# EAGLE design starduino (EAGLE 9.1.0)
DOC_NUM: 1; REVISION: 2.0
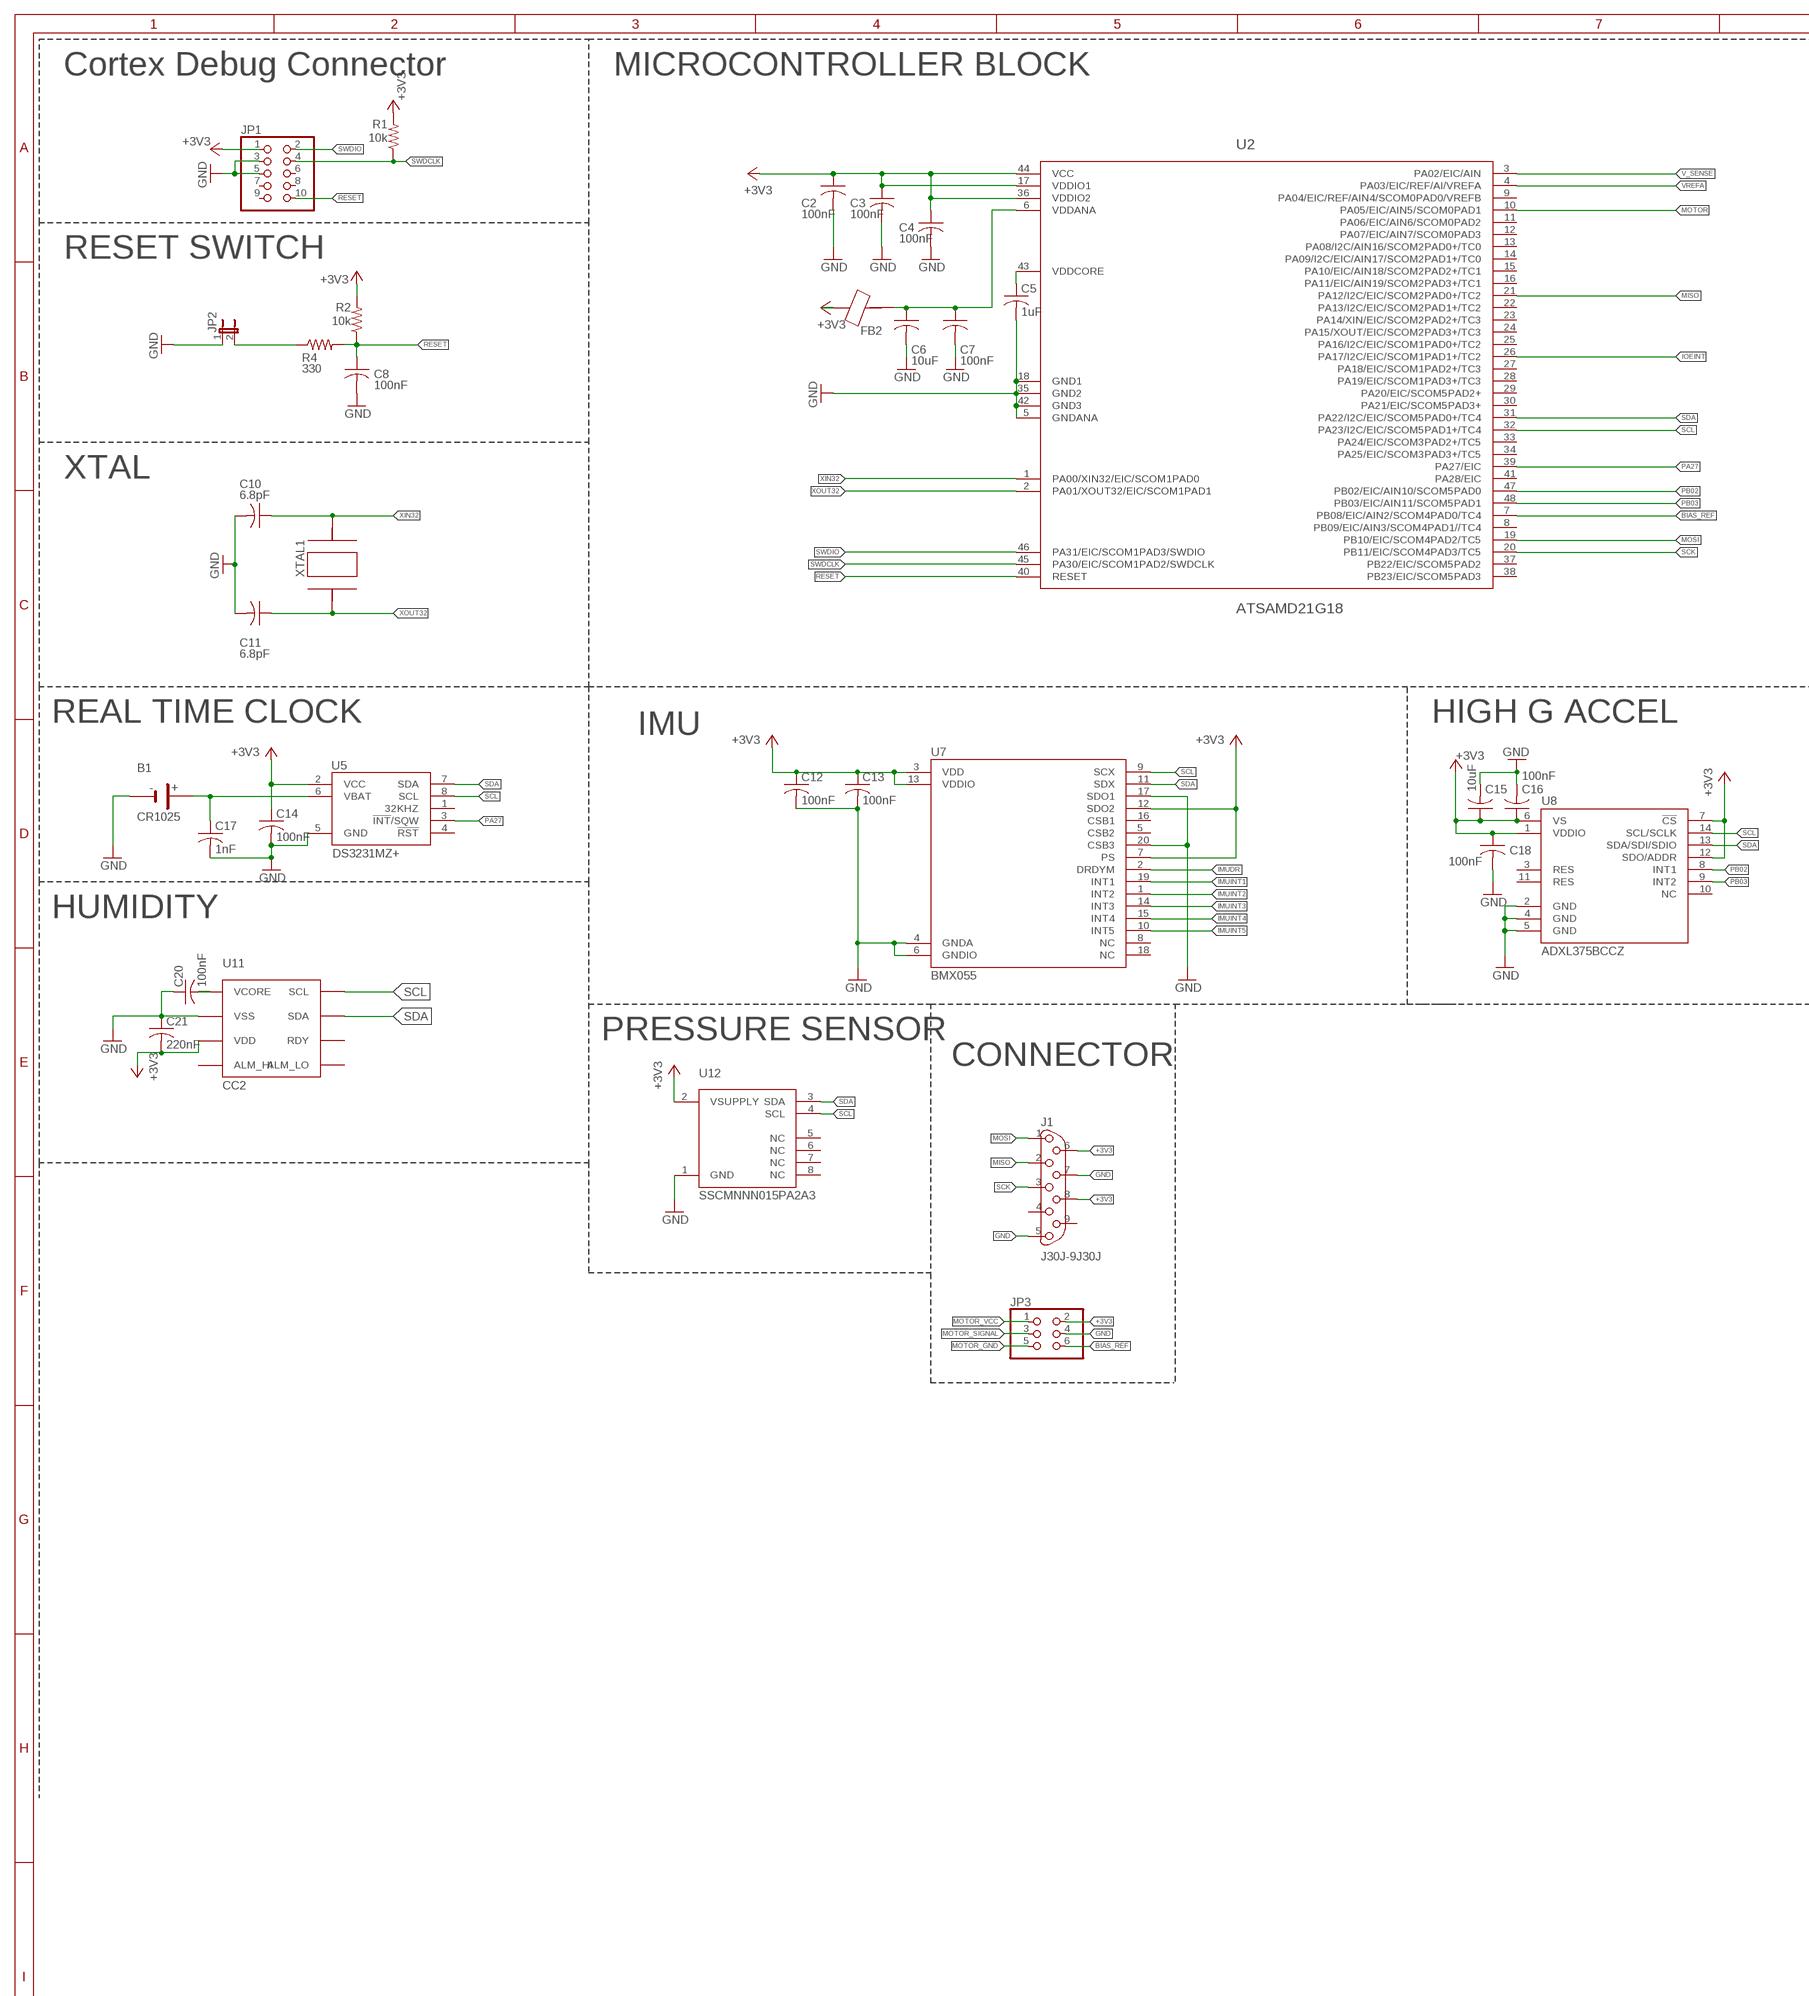
[diagram p0: schematic, sheet 1, part 1 of 2]
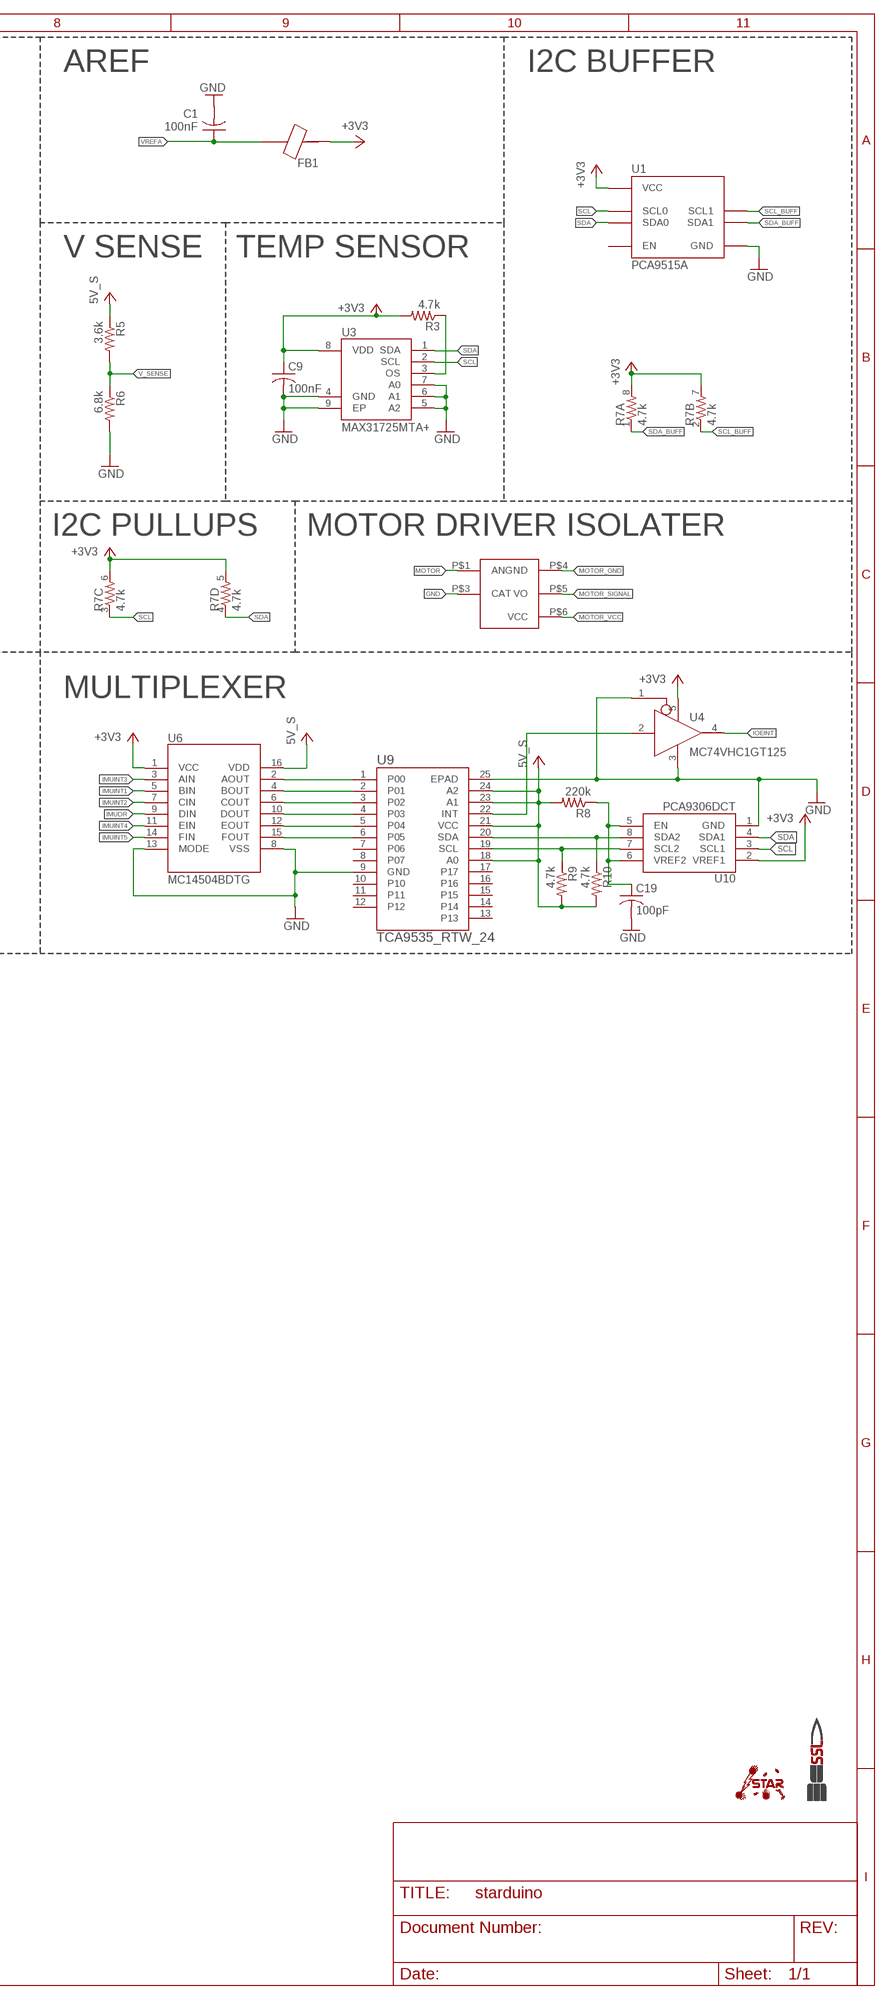
[diagram p1: schematic, sheet 1, part 2 of 2]

## Parts
B1  CR1025  [CR1025]
C1  100nF  C-USC0603  [C0603]
C2  100nF  C-USC0603  [C0603]
C3  100nF  C-USC0603  [C0603]
C4  100nF  C-USC0603  [C0603]
C5  1uF  C-USC0603  [C0603]
C6  10uF  C-USC0603  [C0603]
C7  100nF  C-USC0603  [C0603]
C8  100nF  C-USC0603  [C0603]
C9  100nF  C-USC0603  [C0603]
C10  6.8pF  C-USC0603  [C0603]
C11  6.8pF  C-USC0603  [C0603]
C12  100nF  C-USC0603  [C0603]
C13  100nF  C-USC0603  [C0603]
C14  100nF  C-USC0603  [C0603]
C15  10uF  C-USC0603  [C0603]
C16  100nF  C-USC0603  [C0603]
C17  1nF  C-USC0603  [C0603]
C18  100nF  C-USC0603  [C0603]
C19  100pF  C-USC0603  [C0603]
C20  100nF  C-USC0603  [C0603]
C21  220nF  C-USC0603  [C0603]
FB1  BLM18KG221BH1D  FERRITE_BEAD-0603  [0603]
FB2  BLM18KG221BH1D  FERRITE_BEAD-0603  [0603]
IMAG1  SSL.3IN_SILK  [SSL_SILK_.3IN]
IMAG2  STAR  [STAR_.3IN]
J1  J30J-9J30J  [ZKN-9]
JP1  PINHD-2X5  [2X05]
JP2  JUMPER-2PTH  [1X02]
JP3  PINHD-2X3  [2X03]
R1  10k  R-US_R0603  [R0603]
R2  10k  R-US_R0603  [R0603]
R3  4.7k  R-US_R0603  [R0603]
R4  330  R-US_R0603  [R0603]
R5  3.6k  R-US_R0603  [R0603]
R6  6.8k  R-US_R0603  [R0603]
R7  4.7k  RESISTOR-ARRAY0603-ARV  [0603-ARV]
R8  220k  R-US_R0603  [R0603]
R9  4.7k  R-US_R0603  [R0603]
R10  4.7k  R-US_R0603  [R0603]
U1  PCA9515A  [TSSOP8]
U2  ATSAMD21G18  [48-TQFP]
U3  MAX31725MTA+  [DFN-8]
U4  MC74VHC1GT125  [SC-70-5]
U5  DS3231MZ+  [SOIC-8]
U6  MC14504BDTG  [TSSOP16]
U7  BMX055  [LGA-20]
U8  ADXL375BCCZ  [LGA-14]
U9  TCA9535_RTW_24  [RTW24_2P45X2P45]
U10  PCA9306DCT  [SSOP8]
U11  CC2  [CC2]
U12  SSCMNNN015PA2A3  [HSC-SMT-8]
U$1  FODM8061-D  [SO5]
XTAL1  ABS07AIG-32.768KHZ-1-T  ABS07AIG-32.768KHZ-1-T  [2-SMD]

## Nets
5V_S: R5.1 R8.2 R9.2 R10.2 U6.16(VDD) U9.18(A0) U9.21(VCC) U9.23(A1) U9.24(A2)
+3V3: C2.1 C3.1 C4.1 C9.1 C12.1 C13.1 C14.1 C15.1 C16.1 C18.1 C21.2 FB1.2 FB2.1 J1.6 J1.8 JP1.1 JP3.2 R1.2 R2.2 R3.2 R7.5 R7.6 R7.7 R7.8 U1.P$8(VCC) U2.17(VDDIO1) U2.36(VDDIO2) U2.44(VCC) U3.8(VDD) U4.5(VIN) U5.2(VCC) U6.1(VCC) U7.3(VDD) U7.7(PS) U7.12(SDO2) U7.13(VDDIO) U8.1(VDDIO) U8.6(VS) U8.7(!CS!) U8.12(SDO/ADDR) U10.2(VREF1) U11.P$7(VDD) U12.2(VSUPPLY)
BIAS_REF: JP3.6 U2.7(PB08/EIC/AIN2/SCOM4PAD0/TC4)
GND: B1.3(-) C1.2 C2.2 C3.2 C4.2 C5.2 C6.2 C7.2 C8.2 C9.2 C10.2 C11.2 C12.2 C13.2 C14.2 C15.2 C16.2 C17.2 C18.2 C19.2 C20.1 C21.1 J1.5 J1.7 JP1.3 JP1.5 JP2.1 JP3.4 R6.2 U1.P$4(GND) U2.5(GNDANA) U2.18(GND1) U2.35(GND2) U2.42(GND3) U3.4(GND) U3.5(A2) U3.6(A1) U3.7(A0) U3.9(EP) U4.1(OE) U4.3(GND) U5.5(GND) U6.8(VSS) U6.13(MODE) U7.4(GNDA) U7.6(GNDIO) U7.17(SDO1) U7.20(CSB3) U8.2(GND) U8.4(GND) U8.5(GND) U9.9(GND) U9.25(EPAD) U10.1(GND) U11.P$6(VSS) U12.1(GND) U$1.P$3(CAT)
IMUDR: U6.9(DIN) U7.2(DRDYM)
IMUINT1: U6.5(BIN) U7.19(INT1)
IMUINT2: U6.7(CIN) U7.1(INT2)
IMUINT3: U6.3(AIN) U7.14(INT3)
IMUINT4: U6.11(EIN) U7.15(INT4)
IMUINT5: U6.14(FIN) U7.10(INT5)
IOEINT: U2.26(PA17/I2C/EIC/SCOM1PAD1+/TC2) U4.4(Y)
MISO: J1.2 U2.21(PA12/I2C/EIC/SCOM2PAD0+/TC2)
MOSI: J1.1 U2.19(PB10/EIC/SCOM4PAD2/TC5)
MOTOR: U2.10(PA05/EIC/AIN5/SCOM0PAD1) U$1.P$1(AN)
MOTOR_GND: JP3.5 U$1.P$4(GND)
MOTOR_SIGNAL: JP3.3 U$1.P$5(VO)
MOTOR_VCC: JP3.1 U$1.P$6(VCC)
N$2: C20.2 U11.P$5(VCORE)
N$5: C5.1 U2.43(VDDCORE)
N$6: R3.1 U3.3(OS)
N$7: JP2.2 R4.1
N$8: B1.1(+) B1.2(+) C17.1 U5.6(VBAT)
N$10: C6.1 C7.1 FB2.2 U2.6(VDDANA)
N$19: U6.2(AOUT) U9.1(P00)
N$23: U6.4(BOUT) U9.2(P01)
N$25: U4.2(A) U9.22(INT)
N$28: U6.6(COUT) U9.3(P02)
N$29: U6.10(DOUT) U9.4(P03)
N$30: U6.12(EOUT) U9.5(P04)
N$31: U6.15(FOUT) U9.6(P05)
N$33: R10.1 U9.20(SDA) U10.8(SDA2)
N$34: R9.1 U9.19(SCL) U10.7(SCL2)
N$35: C19.1 R8.1 U10.5(EN) U10.6(VREF2)
PA27: U2.39(PA27/EIC) U5.3(!INT!/SQW)
PB02: U2.47(PB02/EIC/AIN10/SCOM5PAD0) U8.8(INT1)
PB03: U2.48(PB03/EIC/AIN11/SCOM5PAD1) U8.9(INT2)
RESET: C8.1 JP1.10 R2.1 R4.2 U2.40(RESET)
SCK: J1.3 U2.20(PB11/EIC/SCOM4PAD3/TC5)
SCL: R7.3 U1.P$2(SCL0) U2.32(PA23/I2C/EIC/SCOM5PAD1+/TC4) U3.2(SCL) U5.8(SCL) U7.9(SCX) U8.14(SCL/SCLK) U10.3(SCL1) U11.P$4(SCL) U12.4(SCL)
SCL_BUFF: R7.2 U1.P$7(SCL1)
SDA: R7.4 U1.P$3(SDA0) U2.31(PA22/I2C/EIC/SCOM5PAD0+/TC4) U3.1(SDA) U5.7(SDA) U7.11(SDX) U8.13(SDA/SDI/SDIO) U10.4(SDA1) U11.P$3(SDA) U12.3(SDA)
SDA_BUFF: R7.1 U1.P$6(SDA1)
SWDCLK: JP1.4 R1.1 U2.45(PA30/EIC/SCOM1PAD2/SWDCLK)
SWDIO: JP1.2 U2.46(PA31/EIC/SCOM1PAD3/SWDIO)
V_SENSE: R5.2 R6.1 U2.3(PA02/EIC/AIN)
VREFA: C1.1 FB1.1 U2.4(PA03/EIC/REF/AI/VREFA)
XIN32: C10.1 U2.1(PA00/XIN32/EIC/SCOM1PAD0) XTAL1.P2
XOUT32: C11.1 U2.2(PA01/XOUT32/EIC/SCOM1PAD1) XTAL1.P1
Unconnected: J1.4 J1.9 JP1.6 JP1.7 JP1.8 JP1.9 U1.P$5(EN) U2.8(PB09/EIC/AIN3/SCOM4PAD1//TC4) U2.9(PA04/EIC/REF/AIN4/SCOM0PAD0/VREFB) U2.11(PA06/EIC/AIN6/SCOM0PAD2) U2.12(PA07/EIC/AIN7/SCOM0PAD3) U2.13(PA08/I2C/AIN16/SCOM2PAD0+/TC0) U2.14(PA09/I2C/EIC/AIN17/SCOM2PAD1+/TC0) U2.15(PA10/EIC/AIN18/SCOM2PAD2+/TC1) U2.16(PA11/EIC/AIN19/SCOM2PAD3+/TC1) U2.22(PA13/I2C/EIC/SCOM2PAD1+/TC2) U2.23(PA14/XIN/EIC/SCOM2PAD2+/TC3) U2.24(PA15/XOUT/EIC/SCOM2PAD3+/TC3) U2.25(PA16/I2C/EIC/SCOM1PAD0+/TC2) U2.27(PA18/EIC/SCOM1PAD2+/TC3) U2.28(PA19/EIC/SCOM1PAD3+/TC3) U2.29(PA20/EIC/SCOM5PAD2+) U2.30(PA21/EIC/SCOM5PAD3+) U2.33(PA24/EIC/SCOM3PAD2+/TC5) U2.34(PA25/EIC/SCOM3PAD3+/TC5) U2.37(PB22/EIC/SCOM5PAD2) U2.38(PB23/EIC/SCOM5PAD3) U2.41(PA28/EIC) U5.1(32KHZ) U5.4(!RST!) U7.5(CSB2) U7.8(NC) U7.16(CSB1) U7.18(NC) U8.3(RES) U8.10(NC) U8.11(RES) U9.7(P06) U9.8(P07) U9.10 U9.11 U9.12 U9.13 U9.14 U9.15 U9.16 U9.17 U11.P$1(ALM_LO) U11.P$2(RDY) U11.P$8(ALM_HI) U12.5(NC) U12.6(NC) U12.7(NC) U12.8(NC)

## Notes on the sheet
- Cortex Debug Connector | MICROCONTROLLER BLOCK | AREF | I2C BUFFER
- RESET SWITCH
- V SENSE | TEMP SENSOR
- XTAL
- I2C PULLUPS | MOTOR DRIVER ISOLATER
- REAL TIME CLOCK | HIGH G ACCEL
- IMU | MULTIPLEXER
- HUMIDITY
- PRESSURE SENSOR
- CONNECTOR

## Library data of the parts
B1 = NR_connectors:CR1025
C1-C18 C20 C21 = resistor:C-US: CAPACITOR, American symbol
C19 = rcl:C-US: CAPACITOR, American symbol
FB1 FB2 = AR_passives:FERRITE_BEAD
IMAG1 = images:SSL
IMAG2 = images:STAR
J1 = CM_J30J:J30J-9
JP1 = pinhead:PINHD-2X5: PIN HEADER
JP2 = CM_passives:JUMPER-2: Jumper Basic 0.1" spaced jumper. Use with breakaway headers.
JP3 = pinhead:PINHD-2X3: PIN HEADER
R1-R6 = resistor:R-US_: RESISTOR, American symbol
R7 = SparkFun-Passives:RESISTOR-ARRAY: Array Chip Resistor Source: RS Component / Phycomp
R8-R10 = rcl:R-US_: RESISTOR, American symbol
U1 = CM_IC:PCA9515A
U2 = AR_mcu:ATSAMD21G18
U3 = NR_IC:MAX31725MTA+
U4 = CM_IC:MC74VHC1GT125
U5 = NR_IC:DS3231MZ+
U6 = MotorDriver:MC14504BDTG
U7 = NR_IC:BMX055
U8 = NR_IC:ADXL375BCCZ
U9 = MotorDriver:TCA9535_RTW_24; MANUFACTURER_PART_NUMBER: tca9535_rtw_24; VENDOR: Texas Instruments
U10 = MotorDriver:PCA9306
U11 = NR_IC:CC2
U12 = NR_IC:SSCMNNN015PA2A3
U$1 = optoisolater:FODM8061-D
XTAL1 = AR_XTAL:ABS07AIG-32.768KHZ-1-T

## Net classes
0 default: width 0.152 mm, drill 0.381 mm, clearance 0.152 mm
1 PWR_SIG: width 0.203 mm, drill 0.381 mm, clearance 0.152 mm
2 CTRL_SIG: width 0.203 mm, drill 0.381 mm, clearance 0.152 mm
3 DIFF_PAIR: width 0.152 mm, drill 0.33 mm, clearance 0.152 mm

## Board
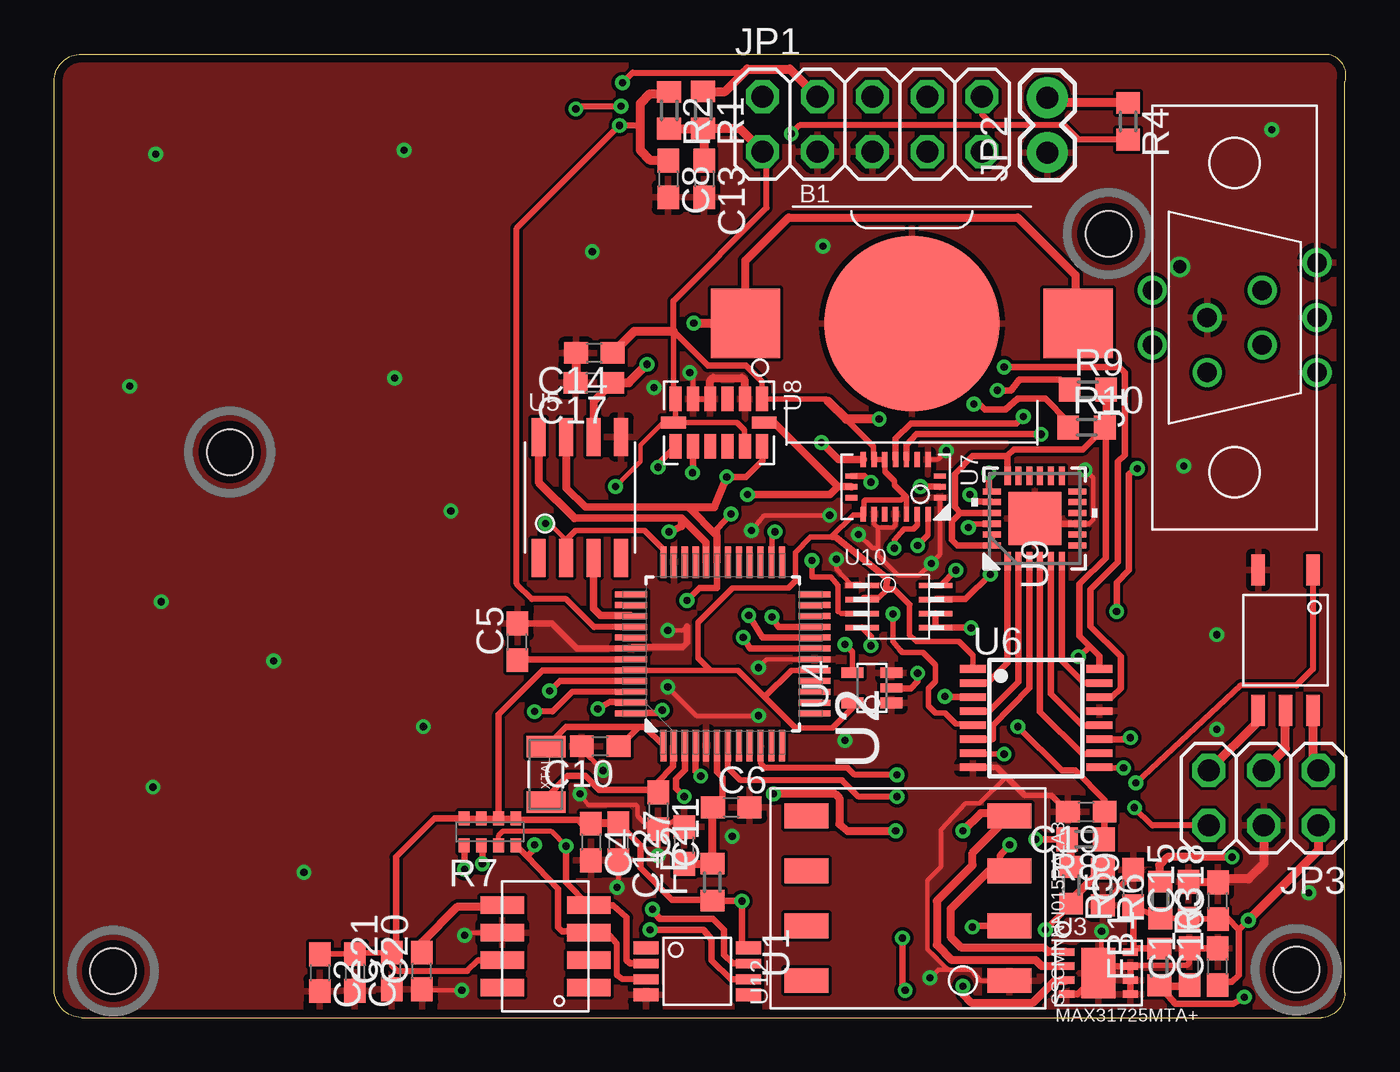
[diagram p2: board, top side]
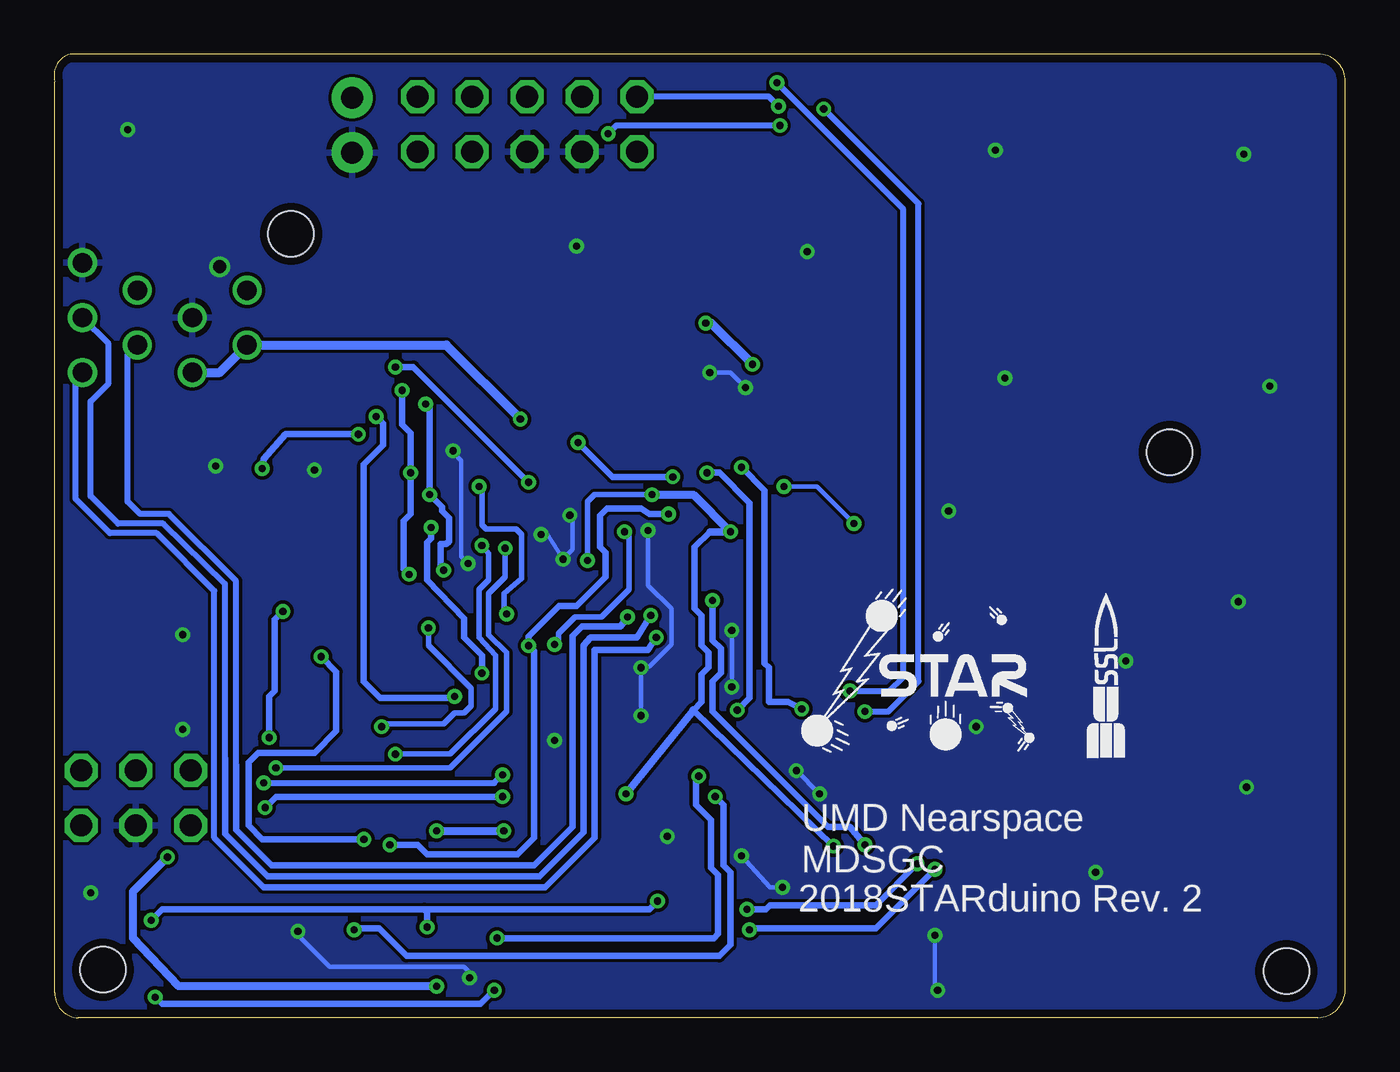
[diagram p3: board, bottom side, seen from below]

Size 59.73 x 44.58 mm. Coordinates in mm from the lower left corner, seen from the top.
Outline: 1.27,0 58.61,0 arc90 59.69,1.14 59.69,43.31 arc90 58.99,44.58 1.27,44.58 arc90 0,43.31 0,1.4 arc90 1.27,0
Copper layers (1*16): Top 0.0356mm / dielectric 1.5011mm / Bottom 0.0356mm
Design rules "OshPark *": minimum track width 6mil, minimum drill 12mil, track to track 6mil, track to pad 6mil, pad to pad 6mil, via to via 6mil, smd to smd 6mil, copper to edge 15mil, drill to drill 6mil, minimum pad ring 7mil, minimum via ring 7mil, stop-mask expansion 3mil, vias tented up to drill 25mil, thermal gap 10mil
Holes 2.1 mm at 8.13,26.16 48.77,36.26 57.47,2.22 2.73,2.16

### Footprints (pad centres in the part's own frame; a part is rotated, then mirrored left to right if it is on the bottom)
CR1025 = smd 3.2 x 3.2: 1 -7.695,0; 2 7.695,0 | smd 8.13 x 8.13: 3 0,0
C0603 = smd 1.1 x 1: 1 -0.85,0; 2 0.85,0
0603 = smd 1 x 1.1: 1 -0.85,0; 2 0.85,0
ZKN-9 = drill 0.9: 1 -2.54,-3.81; 2 -1.27,-1.27; 3 0,-3.81; 4 1.27,-1.27; 5 2.54,-3.81; 6 -2.54,1.27; 7 0,1.27; 8 -1.27,3.81; 9 1.27,3.81
2X05 = drill 1.016 octagon: 1 -5.08,-1.27; 2 -5.08,1.27; 3 -2.54,-1.27; 4 -2.54,1.27; 5 0,-1.27; 6 0,1.27; 7 2.54,-1.27; 8 2.54,1.27; 9 5.08,-1.27; 10 5.08,1.27
1X02 = drill 1.016 pad 1.88: 1 0,0; 2 2.54,0
2X03 = drill 1.016 octagon: 1 -2.54,-1.27; 2 -2.54,1.27; 3 0,-1.27; 4 0,1.27; 5 2.54,-1.27; 6 2.54,1.27
R0603 = smd 1 x 1.1: 1 -0.85,0; 2 0.85,0
0603-ARV = smd 0.5 x 0.65: 1 -1.2,-0.625; 2 -0.4,-0.625; 3 0.4,-0.625; 4 1.2,-0.625; 5 1.2,0.625; 6 0.4,0.625; 7 -0.4,0.625; 8 -1.2,0.625
TSSOP8 = smd 0.6 x 1.15: P$1 -1.087,-2.375; P$4 1.087,-2.375; P$5 1.087,2.375; P$8 -1.087,2.375 | smd 0.45 x 1.15: P$2 -0.362,-2.375; P$3 0.362,-2.375; P$6 0.362,2.375; P$7 -0.362,2.375
48-TQFP = smd 1.473 x 0.279: 1 -4.242,2.743; 2 -4.242,2.261; 3 -4.242,1.753; 4 -4.242,1.245; 5 -4.242,0.762; 6 -4.242,0.254; 7 -4.242,-0.254; 8 -4.242,-0.762; 9 -4.242,-1.245; 10 -4.242,-1.753; 11 -4.242,-2.261; 12 -4.242,-2.743; 25 4.242,-2.743; 26 4.242,-2.261; 27 4.242,-1.753; 28 4.242,-1.245; 29 4.242,-0.762; 30 4.242,-0.254; 31 4.242,0.254; 32 4.242,0.762; 33 4.242,1.245; 34 4.242,1.753; 35 4.242,2.261; 36 4.242,2.743 | smd 0.279 x 1.473: 13 -2.743,-4.242; 14 -2.261,-4.242; 15 -1.753,-4.242; 16 -1.245,-4.242; 17 -0.762,-4.242; 18 -0.254,-4.242; 19 0.254,-4.242; 20 0.762,-4.242; 21 1.245,-4.242; 22 1.753,-4.242; 23 2.261,-4.242; 24 2.743,-4.242; 37 2.743,4.242; 38 2.261,4.242; 39 1.753,4.242; 40 1.245,4.242; 41 0.762,4.242; 42 0.254,4.242; 43 -0.254,4.242; 44 -0.762,4.242; 45 -1.245,4.242; 46 -1.753,4.242; 47 -2.261,4.242; 48 -2.743,4.242
DFN-8 = smd 0.7 x 0.35: 1 -1.475,0.975; 2 -1.475,0.325; 3 -1.475,-0.325; 4 -1.475,-0.975; 5 1.475,-0.975; 6 1.475,-0.325; 7 1.475,0.325; 8 1.475,0.975 | smd 1.58 x 2.35: 9 0,0
SC-70-5 = smd 0.5 x 1: 1 -0.7,-0.9; 3 0.7,-0.9; 4 0.7,0.9; 5 -0.7,0.9 | smd 0.4 x 1: 2 0,-0.9
SOIC-8 = smd 0.65 x 1.75: 1 -1.905,-2.8; 2 -0.635,-2.8; 3 0.635,-2.8; 4 1.905,-2.8; 5 1.905,2.8; 6 0.635,2.8; 7 -0.635,2.8; 8 -1.905,2.8
TSSOP16 = smd 0.35 x 1.2: 1 -2.275,-2.925; 2 -1.625,-2.925; 3 -0.975,-2.925; 4 -0.325,-2.925; 5 0.325,-2.925; 6 0.975,-2.925; 7 1.625,-2.925; 8 2.275,-2.925; 9 2.275,2.925; 10 1.625,2.925; 11 0.975,2.925; 12 0.325,2.925; 13 -0.325,2.925; 14 -0.975,2.925; 15 -1.625,2.925; 16 -2.275,2.925
LGA-20 = smd 0.675 x 0.25: 1 1.262,1.5; 2 1.262,1; 3 1.262,0.5; 4 1.262,0; 5 1.262,-0.5; 6 1.262,-1; 7 1.262,-1.5; 11 -1.262,-1.5; 12 -1.262,-1; 13 -1.262,-0.5; 14 -1.262,0; 15 -1.262,0.5; 16 -1.262,1; 17 -1.262,1.5 | smd 0.25 x 0.55: 8 0.5,-2.05; 9 0,-2.05; 10 -0.5,-2.05; 18 -0.5,2.05; 19 0,2.05; 20 0.5,2.05
LGA-14 = smd 1.145 x 0.55: 1 -1.097,2; 2 -1.097,1.2; 3 -1.097,0.4; 4 -1.097,-0.4; 5 -1.097,-1.2; 6 -1.097,-2; 8 1.097,-2; 9 1.097,-1.2; 10 1.097,-0.4; 11 1.097,0.4; 12 1.097,1.2; 13 1.097,2 | smd 0.55 x 1.145: 7 0,-2.098; 14 0,2.098
RTW24_2P45X2P45 = smd 0.85 x 0.28: 1 -1.975,1.25; 2 -1.975,0.75; 3 -1.975,0.25; 4 -1.975,-0.25; 5 -1.975,-0.75; 6 -1.975,-1.25; 13 1.975,-1.25; 14 1.975,-0.75; 15 1.975,-0.25; 16 1.975,0.25; 17 1.975,0.75; 18 1.975,1.25 | smd 0.28 x 0.85: 7 -1.25,-1.975; 8 -0.75,-1.975; 9 -0.25,-1.975; 10 0.25,-1.975; 11 0.75,-1.975; 12 1.25,-1.975; 19 1.25,1.975; 20 0.75,1.975; 21 0.25,1.975; 22 -0.25,1.975; 23 -0.75,1.975; 24 -1.25,1.975 | smd 2.45 x 2.45: 25 0,0
SSOP8 = smd 0.25 x 1.55: 1 -0.975,-1.7; 2 -0.325,-1.7; 3 0.325,-1.7; 4 0.975,-1.7; 5 0.975,1.7; 6 0.325,1.7; 7 -0.325,1.7; 8 -0.975,1.7
CC2 = smd 2 x 0.8: P$1 2,-1.905; P$2 2,-0.635; P$3 2,0.635; P$4 2,1.905; P$5 -2,1.905; P$6 -2,0.635; P$7 -2,-0.635; P$8 -2,-1.905
HSC-SMT-8 = smd 1.143 x 2.032: 1 -3.81,-4.699; 2 -1.27,-4.699; 3 1.27,-4.699; 4 3.81,-4.699; 5 3.81,4.699; 6 1.27,4.699; 7 -1.27,4.699; 8 -3.81,4.699
SO5 = smd 0.61 x 1.45: P$1 1.27,3.25; P$3 -1.27,3.25; P$4 -1.27,-3.25; P$5 0,-3.25; P$6 1.27,-3.25
2-SMD = smd 1 x 1.8: P1 -1.275,0; P2 1.275,0

### Placement (x,y rotation side)
B1  39.67,32.12 0 top
C1  52.51,2.37 90 top
C2  12.29,2.08 270 top
C3  13.91,2.1 270 top
C4  24.83,8.13 270 top
C5  21.43,17.38 90 top
C6  31.32,9.73 0 top
C7  29.15,7.97 90 top
C8  28.4,38.8 270 top
C9  49.91,6 90 top
C10  25.26,12.56 180 top
C11  27.94,9.57 270 top
C12  26.1,8.14 270 top
C13  30.07,38.8 270 top
C14  24.99,30.75 180 top
C15  52.47,5.43 90 top
C16  53.82,2.37 90 top
C17  24.97,29.37 180 top
C18  53.83,5.41 90 top
C19  47.74,9.53 180 top
C20  17.02,2.16 90 top
C21  15.62,2.16 90 top
FB1  51.12,2.35 90 top
FB2  30.45,6.27 90 top
IMAG1  12.3,12.03 0 bottom
IMAG2  25.16,12.27 0 bottom
J1  54.61,32.39 90 top
JP1  37.85,41.34 0 top
JP2  45.94,40.02 90 top
JP3  55.94,10.16 180 top
R1  30.02,41.99 270 top
R2  28.45,41.97 270 top
R3  51.17,5.45 270 top
R4  49.67,41.47 270 top
R5  47.04,6.13 270 top
R6  48.51,6.05 270 top
R7  20.16,8.6 0 top
R8  47.7,8.26 180 top
R9  47.82,29.05 0 top
R10  47.75,27.3 0 top
U1  29.75,2.14 270 top
U2  30.92,16.83 90 top
U3  48.31,2.06 0 top
U4  37.83,15.26 90 top
U5  24.32,24.07 0 top
U6  45.42,13.86 270 top
U7  38.93,24.56 270 top
U8  30.75,27.53 270 top
U9  45.36,23.1 90 top
U10  39.07,19.02 270 top
U11  22.73,3.3 0 top
U12  39.5,5.52 90 top
U$1  56.96,17.46 0 top
XTAL1  22.75,11.26 90 top

### Tracks (layer width: path | path; a pad name or v marks a point on that pad's centre or on a via)
5V_S  (via drill 0.33 pad 0.33)
  Top 0.305: U9.23 U9.24 41.78,21.85 41.53,22.1 41.53,22.95 41.93,23.35 | U9.18 44.11,26.01 | 44.11,26.01 44.39,26.29 47.59,26.29 R10.2 48.64,27.27 48.64,21.27 47.43,20.07 47.43,17.65 47.91,17.18 | U9.21 41.93,23.35 | 41.93,23.35 41.66,23.62 41.66,25.15 42.48,25.97 44.07,25.97 44.11,26.01 | U6.16 48.34,16.74 47.91,17.18 | R8.2 v45.4,8.26 | v47.37,16.7 47.43,16.7 47.91,17.18
  Top 0.381: R5.1 47.04,8.07 R8.2 | R9.2 48.67,27.37 R10.2
  Bottom 0.305: v45.4,8.26 50.1,8.26 50.74,8.89 50.74,11.81 50.29,12.26 47.69,12.26 46.67,13.27 46.67,16 v47.37,16.7
+3V3  (via drill 0.33, 0.33 pad 0.33)
  Top 0.203: U8.7 28.16,27.53 27.11,26.48 27.11,25.72 v25.97,24.57 | v22.73,22.86 22.92,22.86 23.69,22.1
  Top 0.254: 28.65,31.75 28.65,28.73 U8.6 28.75,27.62 U8.7 31.59,27.53 31.94,27.18 31.94,26.44 U8.12 | 38.54,19.81 38.16,19.43 37.46,19.43 U10.2 | U5.2 23.69,22.1 24.13,22.54 27.31,22.54 28.19,21.65 28.19,21.08 U2.36 | C21.2 13.97,3.01 C3.1 12.3,2.95 C2.1 | C9.1 51.21,4.58 R3.2 52.51,4.59 C15.1 53.82,4.58 C18.1 | U4.5 36.93,14.32 36.01,13.4 34.29,13.4 32.86,14.83 | R7.8 R7.7 R7.6 R7.5 | 32,30.16 32.75,29.42 U8.1 35.7,28.62 35.81,28.51 37.91,26.42 37.91,25.84 U7.12 U7.13 38.43,25.27 38.86,24.83 38.86,24.64 39.37,24.13 | U6.1 42.49,16.75 41.85,17.4 39.88,17.4 39.56,17.72 39.56,19.11 | 35.94,22.22 34.99,22.22 34.29,21.53 34.29,20.19 33.97,19.88 31.37,19.88 29.78,18.29 29.78,16.64 30.35,16.07 | 35.94,22.22 36.01,22.22 | 37.47,23.26 U7.7 | 37.47,23.26 36.97,23.26 35.94,22.22 | U2.44 30.35,16.07 | 32.86,14.83 31.62,16.07 30.35,16.07 | U7.3 39.43,24.07 39.37,24.13 | 37.47,23.26 37.47,23.88 37.53,23.94 39.18,23.94 39.37,24.13 | U2.17 34.1,16.07 32.86,14.83
  Top 0.279: C21.2 15.62,2.41 15.88,2.16 19.11,2.16 19.62,2.67 U11.P$7 | 28.65,31.75 28.65,33.16 32.96,37.47 32.96,39.88 JP1.1
  Top 0.305: 32,30.16 30.24,30.16 28.65,31.75 | U2.44 22.61,16.07 20.56,14.02 R7.6 | FB1.2 49.94,3.2 U3.8 49.91,3.17 C9.1 | C18.1 54.3,4.56 54.8,4.06 | 54.8,4.06 54.8,1.97 54.48,1.65 53.95,1.65 C16.1 | R7.5 21.45,9.14 24.26,9.14 24.42,8.98 C4.1 | v55.25,4.51 54.8,4.06 | 39.56,19.11 38.86,19.81 38.54,19.81 38.48,19.88 38.54,20.32 36.13,22.22 36.01,22.22 | FB2.1 30.47,5.4 v31.81,5.4 31.81,3.42 U1.P$8 | U12.2 42.55,4.25 v42.48,4.19 | R7.8 17.61,9.23 15.81,7.43 15.81,3.2 C21.2 | 30.42,5.45 28.58,5.45 27.11,6.92 27.11,7.98 C12.1
  Top 0.381: C12.1 24.84,8.99 C4.1 | 30.42,5.45 FB2.1
  Top 0.406: JP3.2 58.48,7.75 v55.25,4.51 | v38.16,27.69 36.64,27.69 35.81,28.51 | R2.2 30,41.12 | 30,41.12 R1.2 31.7,41.14 JP1.1 | C14.1 26.84,31.75 28.65,31.75 | 30,41.12 30.07,41.06 C13.1
  Bottom 0.203: v25.97,24.57 24.45,24.57 v22.73,22.86
  Bottom 0.305: v55.25,4.51 54.74,5.02 42.61,5.02 | 42.61,5.02 32.19,5.02 v31.81,5.4 | v42.48,4.19 42.48,4.89 42.61,5.02
  Bottom 0.406: J1.6 52.07,29.84 J1.8 41.59,31.11 v38.16,27.69
BIAS_REF  (via drill 0.33 pad 0.33)
  Top 0.279: JP3.6 50.8,8.89 v49.97,9.71 | v38.99,10.22 37.21,10.22 36.45,10.99 31.75,10.99 31.18,11.56 U2.7
  Bottom 0.305: v49.97,9.71 49.47,10.22 v38.99,10.22
GND  (via drill 0.33, 0.33 pad 0.33, 0.6)
  Top 0.203: U8.5 29.55,29.76 v29.4,29.84 | C12.2 26.1,6.1 v26.04,6.03 | v27.94,7.49 C11.2 | v28.38,17.91 29.08,17.91 29.27,18.1 | C7.2 28.8,9.17 C11.2 | C11.2 27.84,8.83 27.5,8.83 26.99,9.33 26.99,9.78 26.92,9.84 24.7,9.84 v24.32,10.35 | v25.4,11.43 24.32,12.47 C10.2 | v28.38,15.3 29.72,13.97 v32.58,13.97 | U2.18 32.96,16.57 v32.58,16.19 | U12.1 42.86,1.71 42.42,2.22 41.34,2.22 | 41.34,2.22 40.39,3.17 40.39,6.35 41.02,6.98 41.02,8.7 42.16,9.91 42.8,9.91 44.04,11.14 | U7.6 37.93,22.84 38.1,22.67 | 38.1,22.67 38.8,22.67 38.93,22.8 U7.4 | v35.88,23.24 32.83,23.24 v32.26,22.54 | U7.17 40.87,25.82 v41.28,26.23 | U7.20 40.98,21.42 v40.58,21.02 40.01,20.45 39.05,20.45 38.1,21.4 38.1,21.72 | 38.1,22.67 38.1,21.72 | U9.9 47.87,22.85 48.07,23.05 48.07,24.95 v47.69,25.34 | v36.2,21.21 36.2,20.76 36.83,20.07 37.3,20.07 U10.1 | v37.21,22.35 37.85,21.72 38.1,21.72 | v40.51,1.84 40.89,2.22 41.34,2.22 | U3.4 46.89,1.14 48.26,1.14 48.45,1.33 v48.45,4 | U11.P$6 19.11,3.94 v18.99,3.81 | v18.86,1.27 17.06,1.27 C20.1
  Top 0.254: U8.5 U8.4 | C1.2 52.51,2.54 52.39,2.41 49.81,2.41 U3.7 | U6.8 43.6,11.58 44.04,11.14 44.9,10.29 46.12,10.29 C19.2
  Top 0.305: U9.9 45.61,22.85 U9.25 | 29.27,18.1 29.27,17.34 29.08,17.14 26.75,17.14 U2.42 24.19,17.08 23.04,18.23 C5.2 | C1.2 C16.2 | U3.5 U3.6 U3.7 48.63,2.39 U3.9 47.33,1.09 U3.4 | C9.2 49.91,6.72 R6.2
  Top 0.381: U8.4 30.35,29.46 30.48,29.59 31.81,29.59 31.94,29.46 U8.2 | C15.2 53.82,6.28 C18.2
  Top 0.406: JP3.4 55.94,7.11 55.25,6.41 53.98,6.41 C18.2 | C14.2 24.14,29.38 C17.2
  Bottom 0.203: v29.4,29.84 28.45,29.84 v27.75,29.15 | v26.04,6.03 26.61,6.03 v27.94,7.49 | v28.38,15.3 v28.38,17.91 | v24.32,10.35 v25.4,11.43 | v32.58,13.97 v32.58,16.19 32.19,16.26 31.18,17.27 31.18,18.92 32.26,20 v32.26,22.54 | v35.88,23.24 35.75,23.05 35.75,21.65 v36.2,21.21 36.89,22.35 v37.21,22.35 | v41.28,26.23 41.28,26.16 40.89,25.78 40.89,21.34 v40.58,21.02 | v40.51,1.84 40.51,2.09 40.77,2.35 46.99,2.35 48.45,3.81 v48.45,4 | v18.99,3.81 18.99,1.4 v18.86,1.27
  other vias: 35.56,35.69 36.58,12.83 31.37,8.38 18.35,23.43 53.78,13.34 58.04,5.78 52.07,34.73 4.7,39.94 16.19,40.13 15.75,29.59 3.49,29.21 4.95,19.24 10.16,16.51 17.08,13.46 4.57,10.67 11.56,6.73 53.78,17.72 52.26,25.53 56.32,41.08 24.89,35.43
  pour Bottom: -2.54,49.66 -2.54,-2.41 68.58,-2.41 68.58,49.66
  pour Top: -5.08,47.12 -5.08,-3.68 67.31,-3.68 67.31,47.12
IMUDR  (via drill 0.33, 0.33 pad 0.33)
  Top 0.254: U7.2 39.93,22.78 39.75,22.61 39.31,22.61 38.86,22.1 v38.86,21.72 | v49.47,11.56 48.37,11.56 U6.9
  Bottom 0.254: v38.86,21.72 38.86,20.38 39.62,19.62 39.62,17.72 38.8,16.89 38.8,14.16 41.4,11.56 v49.47,11.56
IMUINT1  (via drill 0.33)
  Top 0.254: v38.8,18.67 38.8,17.4 39.12,17.02 39.24,16.89 40.2,16.89 40.77,16.32 40.77,15.56 40.45,15.24 40.45,14.41 40.77,14.1 41.21,14.1 41.72,13.59 42.44,13.59 U6.5
  Top 0.305: v40.07,24.57 40.96,24.57 U7.19
  Bottom 0.254: 38.93,18.8 38.93,19.62 38.1,20.32 38.1,22.35 38.35,22.61 39.75,22.61 39.94,22.8 39.94,24.45 v40.07,24.57
  Bottom 0.305: 38.93,18.8 v38.8,18.67
IMUINT2  (via drill 0.33)
  Top 0.254: U7.1 40.43,22.33 v39.94,21.84 | v43.94,12.19 42.54,12.19 U6.7
  Bottom 0.254: v39.94,21.84 39.62,21.46 39.62,20.26 40.07,19.81 40.07,17.59 39.31,16.76 39.31,14.29 41.4,12.19 v43.94,12.19
IMUINT3  (via drill 0.33)
  Top 0.305: U6.3 41.36,14.83 v41.21,14.86 | U7.14 38.93,26.8 39.62,27.5 44.51,27.5 v44.83,27.81
  Bottom 0.305: v41.21,14.86 41.28,14.79 44.64,14.79 45.4,15.56 45.4,25.59 44.51,26.48 44.51,27.5 v44.83,27.81
IMUINT4  (via drill 0.33)
  Top 0.305: v45.66,26.99 39.88,26.99 39.43,26.48 39.43,25.83 U7.15 | v49.15,18.8 49.15,20.13 49.72,20.7 49.72,25.15 v50.1,25.4 | v49.78,12.95 49.71,12.88 U6.11
  Bottom 0.305: v45.66,26.99 49.02,26.99 50.04,25.84 v50.1,25.4 | v49.78,12.95 49.78,14.86 49.53,15.11 49.53,18.41 v49.15,18.8
IMUINT5  (via drill 0.33)
  Top 0.305: U6.14 48.93,14.83 49.34,15.24 49.34,16.7 47.94,18.1 47.94,19.81 49.21,21.08 49.21,25.72 49.53,26.04 49.53,29.84 49.28,30.1 v43.94,30.1 | v37.78,24.77 37.49,25.06 U7.10
  Bottom 0.305: v43.94,30.1 43.12,30.1 v37.78,24.77
IOEINT  (via drill 0.33)
  Top 0.254: v36.58,17.27 36.93,16.92 U4.4 | U2.26 33.21,21.09 33.21,22.35 v33.34,22.48
  Bottom 0.254: v36.58,17.27 36.39,17.46 36.39,17.78 35.62,18.54 34.42,18.54 33.15,19.81 33.15,22.29 v33.34,22.48
MISO  (via drill 0.33)
  Top 0.305: U2.21 33.5,18.07 v33.21,18.54
  Bottom 0.279: 51.31,11.68 51.31,20.19 54.42,23.3 55.75,23.3 56.33,23.88 56.33,30.67 J1.2
  Bottom 0.305: v33.21,18.54 33.53,18.1 35.31,18.1 35.75,17.65 35.75,8.83 37.53,7.05 49.66,7.05 51.31,8.7 51.31,11.68
MOSI  (via drill 0.33)
  Top 0.305: v31.88,17.59 32.19,17.08 U2.19
  Bottom 0.279: 50.04,6.03 52.32,8.32 52.32,19.75 54.99,22.41 57.15,22.41 58.74,24 58.74,29.53 J1.1
  Bottom 0.305: 50.04,6.03 37.02,6.03 34.73,8.32 34.73,17.02 32.26,17.02 v31.88,17.59
MOTOR  (via drill 0.33 pad 0.33)
  Top 0.279: U$1.P$1 58.23,16.13 57.47,15.37 54.86,15.37 v50.04,10.86 | v38.99,11.24 37.02,11.24 36.7,11.56 32.89,11.56 32.7,11.75 32.7,12.56 U2.10
  Bottom 0.279: v50.04,10.86 39.37,10.86 v38.99,11.24
MOTOR_GND
  Top 0.406: U$1.P$4 55.69,13.72 JP3.5
MOTOR_SIGNAL
  Top 0.406: JP3.3 56.96,12.45 U$1.P$5
MOTOR_VCC
  Top 0.406: U$1.P$6 58.23,11.68 JP3.1
N$2
  Top 0.381: C20.2 17.02,3.49 18.67,5.14 20.67,5.14 U11.P$5
N$5
  Top 0.305: U2.43 21.47,16.57 C5.1
N$6  (via drill 0.33)
  Top 0.381: v42.04,1.46 42.04,1.08 42.42,0.7 45.28,0.7 46.29,1.71 46.81,1.71 U3.3 | v54.48,7.43 51.5,7.43 51.12,7.05 51.12,6.34 R3.1
  Bottom 0.381: v42.04,1.46 53.98,1.46 56.07,3.68 56.07,5.84 v54.48,7.43
N$7
  Top 0.406: R4.1 46.19,42.32 JP2.2
N$8  (via drill 0.33 pad 0.33)
  Top 0.381: B1.1 31.98,35.03 33.97,37.02 44.58,37.02 47.24,34.35 47.24,32.37 B1.2 | C17.1 24.96,28.5 U5.6
  Top 0.406: C17.1 26.58,29.37 v27.43,30.23 | v29.59,32.13 31.96,32.13 B1.1
  Bottom 0.406: v27.43,30.23 29.34,32.13 v29.59,32.13
N$10
  Top 0.305: U2.6 30.67,11.37 30.92,11.11 30.92,10.18 C6.1
  Top 0.381: C7.1 FB2.2 30.45,9.71 C6.1
N$19
  Top 0.305: U9.1 44.11,16.42 43.18,15.49 42.5,15.49 U6.2
N$23
  Top 0.305: U9.2 44.61,15.52 43.24,14.16 42.52,14.16 U6.4
N$25  (via drill 0.33)
  Top 0.254: U9.22 42.47,22.85 v42.29,22.67
  Top 0.305: U4.2 38.75,15.24 39.62,15.24 39.94,15.56 v39.94,15.94
  Bottom 0.305: v42.29,22.67 42.29,22.16 42.48,21.97 42.48,20.26 40.77,18.48 40.77,17.59 39.94,16.76 v39.94,15.94
N$28
  Top 0.305: U9.3 45.11,15.26 43.43,13.53 43.43,12.89 43.36,12.88 U6.6
N$29
  Top 0.305: U9.4 45.61,14.15 47.56,12.19 48.3,12.19 U6.10
N$30
  Top 0.305: U9.5 46.11,14.98 47.56,13.53 48.34,13.53 U6.12
N$31
  Top 0.305: U9.6 46.61,16.51 47.63,15.49 U6.15
N$33  (via drill 0.33)
  Top 0.305: v42.36,24.19 42.36,24.07 42.55,23.88 43.35,23.88 U9.20 | R10.1 46.9,27.58 45.85,28.64 44.58,28.64 44.01,28.13 43.05,28.13 42.8,28.38 v42.55,28.38 | U10.8 41.01,19.99 v41.72,20.7
  Bottom 0.305: v42.55,28.38 42.36,28.19 v42.36,24.19 41.78,23.62 41.78,23.43 41.47,23.11 41.47,22.03 41.59,21.91 41.85,21.91 41.85,20.83 v41.72,20.7
N$34  (via drill 0.33)
  Top 0.254: 40.79,19.37 U10.7
  Top 0.305: R9.1 46.93,29.08 46.93,29.14 46.55,29.53 44.64,29.53 44.26,29.02 v43.62,29.02 | v43.24,25.21 43.24,24.48 U9.19 | 40.79,19.37 42.16,19.37 v43.31,20.51
  Bottom 0.305: v43.31,20.51 43.56,20.76 43.56,22.99 43.24,23.3 v43.24,25.21 43.24,27.05 43.62,27.43 v43.62,29.02
N$35  (via drill 0.33)
  Top 0.305: U10.6 U10.5 42.41,18.04 v42.42,18.03 | R8.1 48.59,8.29 C19.1 48.59,10.09 47.24,11.43 46.61,11.43 v44.58,13.46
  Bottom 0.254: v44.58,13.46 44.45,13.59 41.72,13.59 41.21,14.1 40.77,14.1 40.45,14.41 40.45,15.24 42.42,17.21 v42.42,18.03
PA27
  Top 0.356: U5.3 24.96,18.92 25.27,18.61 26.66,18.61 U2.39
PB02  (via drill 0.33)
  Top 0.305: v27.94,25.46 27.94,25.62 U8.8 | v25.15,14.29 25.72,14.61 26.65,14.61 U2.47
  Bottom 0.305: v27.94,25.46 26.86,24.38 26.86,16.38 26.67,16.19 26.67,14.61 25.78,14.61 v25.15,14.29
PB03  (via drill 0.33)
  Top 0.305: U8.9 29.55,25.23 v29.53,25.21 | v28.13,14.22 28.13,14.16 28.07,14.1 26.7,14.1 U2.48
  Bottom 0.305: v29.53,25.21 28.96,25.21 27.56,23.81 27.56,14.79 v28.13,14.22
RESET  (via drill 0.33 pad 0.33)
  Top 0.279: R4.2 47.4,40.62 46.74,41.28 43.43,41.28 | 27.11,41.28 v26.16,41.28 21.4,36.51 21.4,20.07 22.1,19.37 23.69,19.37 24.98,18.07 U2.40 | JP1.10 42.93,41.78 43.43,41.28 | 43.43,41.28 34.48,41.28 v34.1,40.89
  Top 0.406: C8.1 27.6,39.65 27.11,40.13 27.11,41.28 27.11,42.29 27.56,42.73 28.36,42.73 R2.1
  Bottom 0.279: v34.1,40.89 33.72,41.28 v26.16,41.28
SCK  (via drill 0.33)
  Top 0.305: U2.20 32.77,17.59 v32.13,18.61
  Bottom 0.279: 51.82,12 51.82,20.07 54.67,22.86 56.77,22.86 58.04,24.13 58.04,28.51 57.21,29.34 57.21,31.18 J1.3
  Bottom 0.305: v32.13,18.61 32.77,17.59 34.93,17.59 35.24,17.21 35.24,8.57 37.28,6.54 49.85,6.54 51.82,8.51 51.82,12
SCL  (via drill 0.33)
  Top 0.229: R7.3 20.56,8.43 20.77,8.64 22.99,8.64 v23.69,7.94
  Top 0.254: U10.3 36.43,18.69 36.26,18.8 36.26,20 35.94,20.38 35.05,20.38 v35.05,21.14
  Top 0.305: U1.P$2 26.64,2.51 26.48,2.67 26.48,4.63 25.85,5.21 U11.P$4 23.69,6.25 v23.69,7.94
  Top 0.356: U2.32 30.16,21.97 29.02,23.11 | 24.07,23.11 29.02,23.11 | U8.14 33.31,27.53 36.26,24.57 | 36.26,24.57 36.86,24.57 U7.9 | 29.02,23.11 29.02,22.73 v28.45,22.48 | v32.07,24.19 35.88,24.19 36.26,24.57
  Top 0.381: U5.8 22.42,24.77 24.07,23.11 | U3.2 45.68,2.39 45.4,2.67 41.53,2.67 40.83,3.37 40.83,5.4 42.48,7.05 42.48,7.62 U12.4 44.07,9.46 42.86,9.46 v42.04,8.64 | v33.27,10.35 36.13,10.35 36.32,10.16 36.32,8.95 36.7,8.64 v38.93,8.64
  Bottom 0.254: v35.05,21.14 35.05,23.88 34.73,24.19 v32.07,24.19
  Bottom 0.305: v23.69,7.94 30.16,14.22 29.78,14.61 29.78,15.88 29.46,16.19 29.46,16.89 29.78,17.21 29.78,18.61 30.1,18.92 30.1,21.78 29.4,22.48
  Bottom 0.356: v28.45,22.48 29.4,22.48
  Bottom 0.381: v42.04,8.64 v38.93,8.64 | v33.27,10.35 30.16,14.22 | v32.07,24.19 30.16,24.19 v28.45,22.48
SCL_BUFF  (via drill 0.33 pad 0.33)
  Top 0.305: U1.P$7 31.4,2.51 30.99,2.92 30.99,4.06 30.48,4.57 28,4.57 v27.69,5.02 | v19.81,7.11 19.81,7.93 R7.2
  Bottom 0.305: v19.81,7.11 21.72,5.21 26.61,5.21 26.8,5.02 v27.69,5.02
SDA  (via drill 0.33, 0.33 pad 0.33)
  Top 0.254: 43.75,6.35 U12.3
  Top 0.279: U1.P$3 26.29,1.78 26.04,1.97 26.04,3.43 25.53,4
  Top 0.305: v37.78,17.21 37.78,17.63 U10.4 | U2.31 30.67,19.88 29.85,19.88 v29.27,19.3 | 43.75,6.35 43.75,7.49 v44.2,8 | 32.77,26.41 32.77,25.78 32,25.02 v31.12,25.02 | 30.67,22.29 30.67,22.61 v31.31,23.3 | 25.53,4 24.8,4 | 24.8,4 U11.P$3 | 24.8,4 23.5,4 23.31,4.19 23.31,5.97 21.88,7.46 | 21.88,7.46 R7.4 | v22.23,8 22.23,7.81 21.88,7.46
  Top 0.356: U2.31 30.67,22.29 29.34,23.62 24.58,23.62 23.69,24.51 | U7.11 36.28,25.82 v35.5,26.61 | 32.77,26.41 U8.13
  Top 0.381: U5.7 23.69,24.51 | 29.34,23.62 30.54,23.62 v31.12,25.02 | U3.1 45.98,3.04 45.78,3.24 41.97,3.24 41.47,3.75 41.47,5.02 43.24,6.79 U12.3
  Bottom 0.305: v22.23,8 22.92,8.83 23.94,8.83 29.27,14.16 29.27,15.56 28.89,15.94 28.89,17.08 29.27,17.46 v29.27,19.3 | v44.2,8 42.93,8 42.48,7.56 38.29,7.56 37.53,8.32 37.53,16.95 v37.78,17.21 37.78,17.63 36.36,19.05 35.56,19.05 34.23,20.38 34.23,21.53 34.48,21.78 34.48,23.24 34.16,23.56 32.58,23.56 32.19,23.3 v31.31,23.3 | v31.12,25.02 33.91,25.02 v35.5,26.61
SDA_BUFF  (via drill 0.33 pad 0.33)
  Top 0.305: U1.P$6 31.3,1.78 30.42,2.67 30.42,3.62 30.04,4.06 v27.56,4.06 | v18.99,6.86 18.99,7.95
  Top 0.381: 18.99,7.95 R7.1
  Bottom 0.305: v18.99,6.86 21.72,4.13 27.5,4.13 v27.56,4.06
SWDCLK  (via drill 0.33, 0.33 pad 0.33)
  Top 0.279: v26.29,43.24 26.77,43.72 31.91,43.72
  Top 0.305: U2.45 23.39,15.58 v22.92,15.11
  Top 0.406: R1.1 31.03,42.84 31.91,43.72 32.07,43.88 34.04,43.88 JP1.4
  Bottom 0.279: v22.92,15.11 21.08,15.11 20.45,15.75 20.45,37.4 v26.29,43.24
SWDIO  (via drill 0.33 pad 0.33)
  Top 0.279: U2.46 23.97,15.08 23.05,14.16 v22.23,14.16 | v24.13,42.04 24.26,42.16 v26.23,42.16
  Bottom 0.279: v22.23,14.16 21.15,14.16 19.75,15.56 19.75,37.66 v24.13,42.04 | v26.23,42.16 26.67,42.61 JP1.2
V_SENSE  (via drill 0.33)
  Top 0.305: U2.3 29.17,11.46 28.77,11.05 28.77,10.6 v29.15,10.22 | R5.2 46.49,4.71 v45.85,4.06
  Top 0.381: R5.2 47.04,5.42 R6.1
  Bottom 0.305: v29.15,10.22 28.77,9.84 28.77,7.05 28.45,6.73 28.45,3.37 28.96,2.86 43.43,2.86 44.7,4.13 45.78,4.13 v45.85,4.06
VREFA  (via drill 0.33)
  Top 0.305: U2.4 29.68,11.41 v29.91,11.18 | v55.05,0.95 54.55,0.64 51.86,0.64 FB1.1 | v39.24,3.68 39.24,1.4 v39.37,1.27
  Top 0.381: FB1.1 52.5,1.44 C1.1
  Bottom 0.305: v39.37,1.27 40.01,0.64 54.74,0.64 v55.05,0.95 | v29.91,11.18 30.04,11.05 30.04,9.84 29.34,9.14 29.34,6.92 29.02,6.6 29.02,3.87 29.21,3.68 v39.24,3.68
XIN32
  Top 0.305: U2.1 27.31,13.46 27.05,13.46 | 27.05,13.46 26.15,12.56 C10.1 | XTAL1.P2 23.68,13.46 27.05,13.46
XOUT32
  Top 0.305: U2.2 28.64,12.56 28.64,11.62 27.89,10.87 C11.1 27.82,10.54 25.21,10.54 24.58,11.18 23.75,11.18 22.75,10.18 XTAL1.P1

### Text on the board
bPlace: UMD Nearspace / MDSGC | 2018STARduino Rev. 2
ASM_Res: 4.7k | 10k | 3.6k | 4.7k | 4.7k | 10k | 4.7k | 6.8k | 4.7k | 100k | 10k | 845k | 33k | 158k | 100k | 191k | 100k | 191k | 191k | 10k | 1.05 | 1.05 | 33k | 100k | 191k | 6.2 | 10k | 4.7k | 4.7k | 4.7k | 330 | 270k
ASM_IC: P82B75 | FDG8842 | MIC5319 | MT25QL | SAMD21 | FDG8842 | FDG8842 | FDG8842 | LTC3112 | TCA9535 | DS3231 | MC14504 | ADXL375 | MAX31275 | BMX055 | LT8301 | LT3465 | PCA9306
ASM_Cap: 6.8pF | 100nF | 6.8pF | 100nF | 1uF | 100nF | 1uF | 47uF | 10uF | 47pF | 1uF | 4.7uF | 680pF | 22pF | 1uF | 100nF | 2.2uF | 100nF | 100nF | 10uF | 100nF | 1uF | 4.7uF | 10uF | 100nF | 100nF | 1nF | 1uF | 10uF | 100nF | 100nF | 100nF | 10uF | 100nF | 100nF | 10uF | 100nF | 100nF
ASM_Misc: 10uH | 10uH | 10uH | 32kHz | 10uH | 4.7uH | STPS1150 | CMDZ5257B | CMHD4448 | 22uH | Ferrite Bead